# Altium schematic sheet PowerSupply.SchDoc
size A4
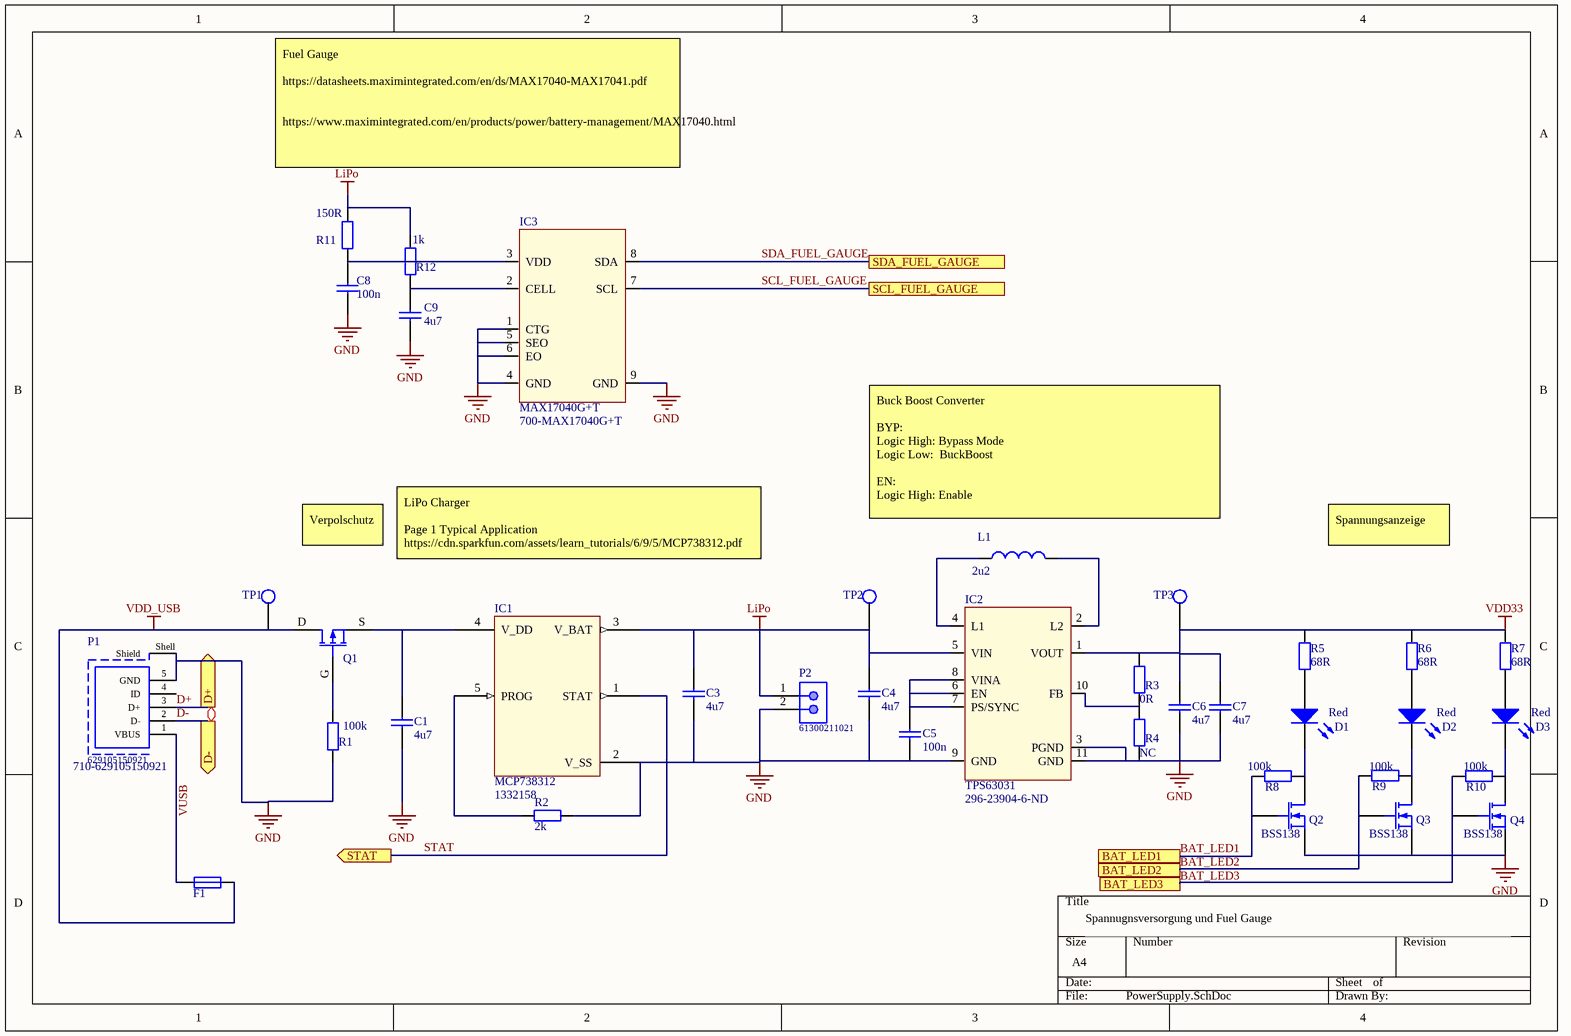
[diagram p0: PowerSupply.SchDoc]

## Parts
C1  4u7  [CAPC1005X55]
C3  4u7  [CAPC1005X55]
C4  4u7  [CAPC1005X55]
C5  100n  [CAPC1005X55]
C6  4u7  [CAPC1005X55]
C7  4u7  [CAPC1005X55]
C8  100n  [CAPC1005X55]
C9  4u7  [CAPC1005X55]
D1  Red  [LEDC2012X90]
D2  Red  [LEDC2012X90]
D3  Red  [LEDC2012X90]
F1  (no value)  [RESC3216X65]
IC1  MCP738312  Supplier Part Number 1: 1332158  [MCP738312]
IC2  TPS63031  Supplier Part Number 1: 296-23904-6-ND  [TPS63031]
IC3  MAX17040G+T  Supplier Part Number 1: 700-MAX17040G+T  [MAX17040G+T]
L1  2u2  [INDM3030X150]
P1  629105150921  Supplier Part Number 1: 710-629105150921  [629105150921]
P2  61300211021  [61300211021]
Q1  IRLML9301TRPBF  [SOT95P240X130_SGD-3]  (value not drawn)
Q2  BSS138  [SOT95P240X130_SGD-3]
Q3  BSS138  [SOT95P240X130_SGD-3]
Q4  BSS138  [SOT95P240X130_SGD-3]
R1  100k  [RESC1005X40]
R2  2k  [RESC1005X40]
R3  0R  [RESC1005X40]
R4  NC  [RESC1005X40]
R5  68R  [RESC1005X40]
R6  68R  [RESC1005X40]
R7  68R  [RESC1005X40]
R8  100k  [RESC1005X40]
R9  100k  [RESC1005X40]
R10  100k  [RESC1005X40]
R11  150R  [RESC1005X40]
R12  1k  [RESC1005X40]
TP1  Testpoint  [TP200A]  (value not drawn)  (no BOM)
TP2  Testpoint  [TP200A]  (value not drawn)  (no BOM)
TP3  Testpoint  [TP200A]  (value not drawn)  (no BOM)

## Ports
BAT_LED1, BAT_LED2, BAT_LED3, D+ (out), D- (out), SCL_FUEL_GAUGE, SDA_FUEL_GAUGE, STAT (out)

## Nets
GND: C1.1 C3.1 C4.1 C5.2 C6.1 C7.1 C8.1 C9.1 IC1.2(V_SS) IC2.3(PGND) IC2.9(GND) IC2.11(GND) IC3.1(CTG) IC3.4(GND) IC3.5(SEO) IC3.6(EO) IC3.9(GND) P1.5(GND) P1.Shell(Shield) P2.2 Q2.S Q3.S Q4.S R1.1 R2.1 R4.1
LiPo: C3.2 C4.2 IC1.3(V_BAT) IC2.5(VIN) P2.1 R11.2 R12.2 TP2.1
VDD33: C6.2 C7.2 IC2.1(VOUT) R3.2 R5.2 R6.2 R7.2 TP3.1
VDD_USB: F1.2 Q1.D TP1.1
BAT_LED1: Q2.G R8.1 ; port BAT_LED1
BAT_LED2: Q3.G R9.1 ; port BAT_LED2
BAT_LED3: Q4.G R10.1 ; port BAT_LED3
D+: P1.3(D+) ; port D+
D-: P1.2(D-) ; port D-
SCL_FUEL_GAUGE: IC3.7(SCL) ; port SCL_FUEL_GAUGE
SDA_FUEL_GAUGE: IC3.8(SDA) ; port SDA_FUEL_GAUGE
STAT: IC1.1(STAT) ; port STAT
NetC1_2: C1.2 IC1.4(V_DD) Q1.S
NetC5_1: C5.1 IC2.6(EN) IC2.7(PS/SYNC) IC2.8(VINA)
NetC8_2: C8.2 IC3.3(VDD) R11.1
NetC9_2: C9.2 IC3.2(CELL) R12.1
NetD1_1: D1.1(K) Q2.D R8.2
NetD1_2: D1.2(A) R5.1
NetD2_1: D2.1(K) Q3.D R9.2
NetD2_2: D2.2(A) R6.1
NetD3_1: D3.1(K) Q4.D R10.2
NetD3_2: D3.2(A) R7.1
NetF1_1: F1.1 P1.1(VBUS)
NetIC1_5: IC1.5(PROG) R2.2
NetIC2_2: IC2.2(L2) L1.2
NetIC2_4: IC2.4(L1) L1.1
NetIC2_10: IC2.10(FB) R3.1 R4.2
NetQ1_G: Q1.G R1.2

Not connected (* = marked no-connect by the designer): P1 4(ID)

## Layout directives
differential pair: D+, D-

## Notes on the sheet
- Fuel Gauge
  https://datasheets.maximintegrated.com/en/ds/MAX17040-MAX17041.pdf
  https://www.maximintegrated.com/en/products/power/battery-management/MAX17040.html
- (near L1) Buck Boost Converter
  BYP:
  Logic High: Bypass Mode
  Logic Low:  BuckBoost
  EN:
  Logic High: Enable
- Verpolschutz
- LiPo Charger
  Page 1 Typical Application
  https://cdn.sparkfun.com/assets/learn_tutorials/6/9/5/MCP738312.pdf
  https://cdn.sparkfun.com/datasheets/Prototyping/USB_LiPolyCharger_SingleCell21.pdf
- Spannungsanzeige
- Spannugnsversorgung und Fuel Gauge
- Labels drawn without touching a wire or pin: VUSB

## Library data of the parts
C1 C9 = 1257: Ceramic Chip Capacitor; Manufacturer ID: C1005X5R1A475K050BC; Manufacturer: TDK; ID: 1257; Type: Standard Ceramic; Voltage: 10V; Characteristic: X5R; Tolerance: ±10%; UBiKS Number: UBiKS-C00144Y; Value: 4u7; Dielectric: Ceramic; Footprint / Size: C0402; Digikey: 445-13820-1-ND; Distributor 3: Mouser; Distributor Number 3: 810-C1005X5R1A475KBC; ComponentLink1Description: Website; ComponentLink1URL: http://product.tdk.com/capacitor/mlcc/detailed_information.php?lang=en&part_no=C1005X5R1A475K050BC; ComponentLink2Description: Datasheet; ComponentLink2URL: http://product.tdk.com/en/catalog/datasheets/mlcc_commercial_general_en.pdf
C3 C4 C6 C7 = 1253: Ceramic Chip Capacitor; Manufacturer ID: GRM155R60J475ME47D; Manufacturer: Murata; ID: 1253; Type: Standard Ceramic; Voltage: 6.3V; Characteristic: X5R; Tolerance: ±20%; UBiKS Number: UBiKS-C00140A; Value: 4u7; Dielectric: Ceramic; Footprint / Size: C0402; Farnell: 2426952; ComponentLink1Description: Website; ComponentLink1URL: http://www.murata.com/; ComponentLink2Description: Datasheet; ComponentLink2URL: http://www.farnell.com/datasheets/1769893.pdf
C5 = 1066: Manufacturer ID: C0402C104K4RAC; Manufacturer: Kemet; ID: 1066; Type: Standard Ceramic; Voltage: 16V; Dielectric: Ceramic; Characteristic: X7R; Tolerance: ±15%; UBiKS Number: UBiKS-C00001I; Value: 100n; Footprint / Size: C0402; Farnell: 1288252; Digikey: 399-3521-1-ND; Distributor 3: Mouser; Distributor Number 3: 80-C0402C104K4RAUTO; Unit Price: 0; Quantity: 0; ComponentLink1Description: Website; ComponentLink1URL: http://kemet.com/; ComponentLink2Description: Datasheet; ComponentLink2URL: http://www.kemet.com/kemet/web/homepage/kechome.nsf/vapubfiles/F3102_X7R.pdf/$file/F3102_X7R.pdf
C8 = 1066: Ceramic Chip Capacitor; Manufacturer ID: C0402C104K4RAC; Manufacturer: Kemet; ID: 1066; Type: Standard Ceramic; Voltage: 16V; Characteristic: X7R; Tolerance: ±15%; UBiKS Number: UBiKS-C00001I; Value: 100n; Dielectric: Ceramic; Footprint / Size: C0402; Farnell: 1288252; Digikey: 399-3521-1-ND; Distributor 3: Mouser; Distributor Number 3: 80-C0402C104K4RAUTO; Unit Price: 0; Quantity: 0; ComponentLink1Description: Website; ComponentLink1URL: http://kemet.com/; ComponentLink2Description: Datasheet; ComponentLink2URL: http://www.kemet.com/kemet/web/homepage/kechome.nsf/vapubfiles/F3102_X7R.pdf/$file/F3102_X7R.pdf
D1-D3 = 6010: SMD Chip LED; Manufacturer ID: HSMS-C170; Manufacturer: Avago; ID: 6010; Type: Standard LED; UBiKS Number: UBiKS-V00002H; Color: red; Footprint / Size: LED0805; Farnell: 5790839; ComponentLink1Description: Website; ComponentLink1URL: http://www.avagotech.com/; ComponentLink2Description: Datasheet; ComponentLink2URL: http://www.avagotech.com/docs/AV02-0376EN
F1 = 8021: 0.5A PTC Fuse; Manufacturer ID: 1206L050/15YR; Manufacturer: POLY-FUSE; ID: 8021; UBiKS Number: UBiKS-M00020W; Type: Fuse; Footprint / Size: 3.2mm x 1.6 mm x 0.75mm; Digikey: F3733TR-ND; ComponentLink1Description: Website; ComponentLink1URL: http://www.littelfuse.de/; ComponentLink2Description: Datasheet; ComponentLink2URL: http://www.littelfuse.com/data/en/Data_Sheets/Littelfuse_PTC_1206L.pdf
L1 = 3006: SMD Inductor; Manufacturer ID: NR3015T2R2M; Manufacturer: Taiyo Yuden; ID: 3006; max DC Current: 1.48A; Resistance: 72mR; Tolerance: ± 20%; UBiKS Number: UBiKS-L00005P; Type: Inductor; Value: 2u2; Footprint / Size: IND3x3x1,5mm; Digikey: 587-1648-6-ND; ComponentLink1Description: Website; ComponentLink1URL: http://www.yuden.co.jp/; ComponentLink2Description: Datasheet; ComponentLink2URL: http://www.yuden.co.jp/ut/product/pdf/enr4_e.pdf
P1 = 629105150921: Micro USB 2.0 Type AB Receptacle WR-COM, Horizontal, SMT; Rated Current: 1.8 A; Contact Resistance: 30 mOhm; Working Voltage: 30 VAC; ComponentLink1Description: Manufacturer; ComponentLink1URL: http://www.we-online.de; ComponentLink2Description: Datasheet; ComponentLink2URL: https://katalog.we-online.de/em/datasheet/629105150921.pdf; Part Number: 629105150921; Published Date: September 2018; Publisher: Wurth Elektronik; Orientation: Horizontal; Connector Type: Micro USB 2.0 Type AB; Operating Temperature: -40 to 85 degC; Mounting Technology: SMT; Gender: Receptacle; Packaging: Tape and Reel; Supplier 1: Mouser
P2 = 61300211021: THT Angled Pin Header WR-PHD, Pitch 2.54 mm, Single Row, 2 pins; Pin Number: 2; Pitch: 2.54 mm; Gender: Male; Rated Current: 3 A; Working Voltage: 250 VAC; Withstanding Voltage: 500 VAC; Contact Resistance: 20 mOhm; ComponentLink1Description: Manufacturer; ComponentLink1URL: http://www.we-online.de; ComponentLink2Description: Datasheet; ComponentLink2URL: https://katalog.we-online.de/em/datasheet/6130xx11021.pdf; Part Number: 61300211021; Published Date: August 2018; Publisher: Wurth Elektronik; Operating Temperature: -40 to 105 degC; Mounting Technology: THT; Packaging: Bag; Row Number: Single; Orientation: Angled
Q1 = 4524: P-channel enhancement mode MOS transistor; Manufacturer: International Rectifier; ID: 4524; Type: MOSFET P enh.; UBiKS Number: UBiKS-Q00018R; Manufacturer ID: IRLML9301TRPBF; Footprint / Size: SOT-23; Farnell: 1831089RL; Digikey: IRLML9301TRPBFCT-ND; ComponentLink1Description: Website; ComponentLink1URL: http://www.irf.com; ComponentLink2Description: Datasheet; ComponentLink2URL: http://www.irf.com/product-info/datasheets/data/irlml9301pbf.pdf
Q2-Q4 = 4512: N-channel enhancement mode MOS transistor; Manufacturer: Infineon; ID: 4512; Type: MOSFET N enh.; UBiKS Number: UBiKS-Q00007G; Manufacturer ID: BSS138; Footprint / Size: SOT-23; Farnell: 1156434; ComponentLink1Description: Website; ComponentLink1URL: http://www.infineon.com; ComponentLink2Description: Datasheet; ComponentLink2URL: http://www.farnell.com/datasheets/46045.pdf
R1 R8-R10 = 2121: Resistor; Manufacturer ID: MC 0.0625W 0402 1% 100K; Manufacturer: Multicomp; ID: 2121; Element Type: Thick Film; Tolerance: ±1%; Power rating: 0.063W; Temperatur coeff: ±100ppm/°C; UBiKS Number: UBiKS-R00005V; Type: Standard; Value: 100k; Footprint / Size: R0402; Farnell: 1358096; ComponentLink1Description: Website; ComponentLink2Description: Datasheet; ComponentLink2URL: http://www.farnell.com/datasheets/318400.pdf
R2 = 2144: Resistor; Manufacturer ID: MC 0.0625W 0402 1% 2K; Manufacturer: Multicomp; ID: 2144; Element Type: Thick Film; Tolerance: ±1%; Power rating: 0.063W; Temperatur coeff: ±100ppm/°C; UBiKS Number: UBiKS-R00028X; Type: Standard; Value: 2k; Footprint / Size: R0402; Farnell: 1358050; ComponentLink1Description: Website; ComponentLink2Description: Datasheet; ComponentLink2URL: http://www.farnell.com/datasheets/318400.pdf
R3 = 2117: Resistor; Manufacturer ID: MC 0.0625W 0402 1% 0R; Manufacturer: Multicomp; ID: 2117; Element Type: Thick Film; Tolerance: ±1%; Power rating: 0.063W; Temperatur coeff: ±200ppm/°C; UBiKS Number: UBiKS-R00001X; Type: Standard; Value: 0R; Footprint / Size: R0402; Farnell: 1357983; ComponentLink1Description: Website; ComponentLink2Description: Datasheet; ComponentLink2URL: http://www.farnell.com/datasheets/318400.pdf
R4 = 2117: Resistor; Manufacturer ID: MC 0.0625W 0402 1% 0R; Manufacturer: Multicomp; ID: 2117; Value: 0R; Element Type: Thick Film; Tolerance: ±1%; Power rating: 0.063W; Temperatur coeff: ±200ppm/°C; UBiKS Number: UBiKS-R00001X; Type: Standard; Footprint / Size: R0402; Farnell: 1357983; ComponentLink1Description: Website; ComponentLink2Description: Datasheet; ComponentLink2URL: http://www.farnell.com/datasheets/318400.pdf
R5-R7 = 2292: Resistor; Manufacturer ID: MC 0.0625W 0402 1% 68R; Manufacturer: Multicomp; ID: 2292; Element Type: Thick Film; Tolerance: ±1%; Power rating: 0.063W; Temperatur coeff: ±200ppm/°C; UBiKS Number: UBiKS-R00160Z; Type: Standard; Value: 68R; Footprint / Size: R0402; Farnell: 1358011; Unit Price: 0; Quantity: 0; ComponentLink1Description: Website; ComponentLink2Description: Datasheet; ComponentLink2URL: http://www.farnell.com/datasheets/318400.pdf
R11 = 2219: Resistor; Manufacturer ID: MC 0.0625W 0402 1% 150R; Manufacturer: Multicomp; ID: 2219; Element Type: Thick Film; Tolerance: ±1%; Power rating: 0.063W; Temperatur coeff: ±100ppm/°C; UBiKS Number: UBiKS-R00096U; Type: Standard; Value: 150R; Footprint / Size: R0402; Farnell: 1358020; ComponentLink1Description: Website; ComponentLink2Description: Datasheet; ComponentLink2URL: http://www.farnell.com/datasheets/318400.pdf
R12 = 2154: Resistor; Manufacturer ID: MC 0.0625W 0402 1% 1K; Manufacturer: Multicomp; ID: 2154; Element Type: Thick Film; Tolerance: ±1%; Power rating: 0.063W; Temperatur coeff: ±100ppm/°C; UBiKS Number: UBiKS-R00038C; Type: Standard; Value: 1k; Footprint / Size: R0402; Farnell: 1358043; ComponentLink1Description: Website; ComponentLink2Description: Datasheet; ComponentLink2URL: http://www.farnell.com/datasheets/318400.pdf
TP1-TP3 = 8002: Testpoint 2mm; ID: 8002; UBiKS Number: UBiKS-M00002Y; Type: Testpoint
IC1 = MCP738312: Supplier 1: Farnell
IC2 = TPS63031: Supplier 1: Digi-Key
IC3 = MAX17040G+T: Supplier 1: Mouser